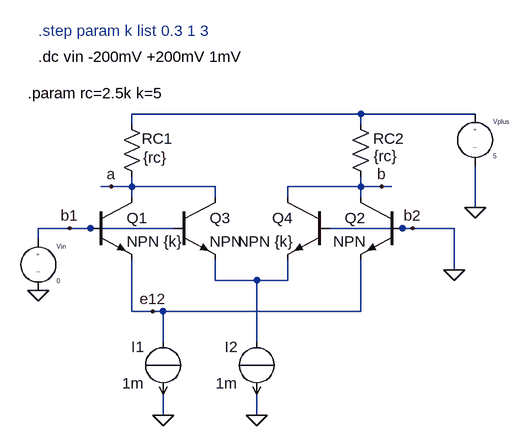
[diagram p0: schematic diff_large.asc]
diff_large.asc, the LTspice schematic file:
Version 4
SHEET 1 880 680
WIRE 560 -32 208 -32
WIRE 736 -32 560 -32
WIRE 208 -16 208 -32
WIRE 560 -16 560 -32
WIRE 176 80 160 80
WIRE 208 80 208 64
WIRE 208 80 176 80
WIRE 336 80 208 80
WIRE 560 80 560 64
WIRE 560 80 448 80
WIRE 592 80 560 80
WIRE 608 80 592 80
WIRE 208 96 208 80
WIRE 336 96 336 80
WIRE 448 96 448 80
WIRE 560 96 560 80
WIRE 736 112 736 48
WIRE 112 144 64 144
WIRE 144 144 112 144
WIRE 272 144 144 144
WIRE 624 144 512 144
WIRE 640 144 624 144
WIRE 704 144 640 144
WIRE 64 160 64 144
WIRE 704 208 704 144
WIRE 336 224 336 192
WIRE 400 224 336 224
WIRE 448 224 448 192
WIRE 448 224 400 224
WIRE 208 272 208 192
WIRE 240 272 208 272
WIRE 256 272 240 272
WIRE 560 272 560 192
WIRE 560 272 256 272
WIRE 256 320 256 272
WIRE 400 320 400 224
WIRE 256 432 256 400
WIRE 400 432 400 400
FLAG 736 112 0
FLAG 256 432 0
FLAG 112 144 b1
FLAG 640 144 b2
FLAG 240 272 e12
FLAG 704 208 0
FLAG 592 80 b
FLAG 176 80 a
FLAG 64 240 0
FLAG 400 432 0
SYMBOL source-I 256 400 R180
WINDOW 0 29 73 Left 2
WINDOW 3 29 17 Left 2
SYMATTR InstName I1
SYMATTR Value 1m
SYMBOL EIT_Semiconductors\\npn 144 96 R0
SYMATTR InstName Q1
SYMATTR Value NPN {k}
SYMBOL EIT_Semiconductors\\npn 624 96 M0
SYMATTR InstName Q2
SYMBOL source-V 64 144 R0
SYMATTR InstName Vin
SYMATTR Value 0
SYMBOL source-V 736 -48 R0
SYMATTR InstName Vplus
SYMATTR Value 5
SYMBOL res 192 -32 R0
WINDOW 0 31 38 Left 2
WINDOW 3 33 67 Left 2
SYMATTR InstName RC1
SYMATTR Value {rc}
SYMBOL res 544 -32 R0
WINDOW 0 35 38 Left 2
WINDOW 3 36 65 Left 2
SYMATTR InstName RC2
SYMATTR Value {rc}
SYMBOL EIT_Semiconductors\\npn 272 96 R0
SYMATTR InstName Q3
SYMBOL EIT_Semiconductors\\npn 512 96 M0
SYMATTR InstName Q4
SYMATTR Value NPN {k}
SYMBOL source-I 400 400 R180
WINDOW 0 29 73 Left 2
WINDOW 3 29 17 Left 2
SYMATTR InstName I2
SYMATTR Value 1m
TEXT 64 -120 Left 2 !.dc vin -200mV +200mV 1mV
TEXT 48 -64 Left 2 !.param rc=2.5k k=5
TEXT 64 -160 Left 2 ;.step param k list 0.3 1 3

The netlist it stands for:
* diff_large.asc
I1 e12 0 1m
Q1 a b1 e12 0 NPN {k}
Q2 b 0 e12 0 NPN
Vin b1 0 0
Vplus N001 0 5
RC1 N001 a {rc}
RC2 N001 b {rc}
Q3 a b1 N002 0 NPN
Q4 b 0 N002 0 NPN {k}
I2 N002 0 1m
.model NPN NPN
.model PNP PNP
.lib standard.bjt
.dc vin -200mV +200mV 1mV
.param rc=2.5k k=5
* .step param k list 0.3 1 3
.backanno
.end